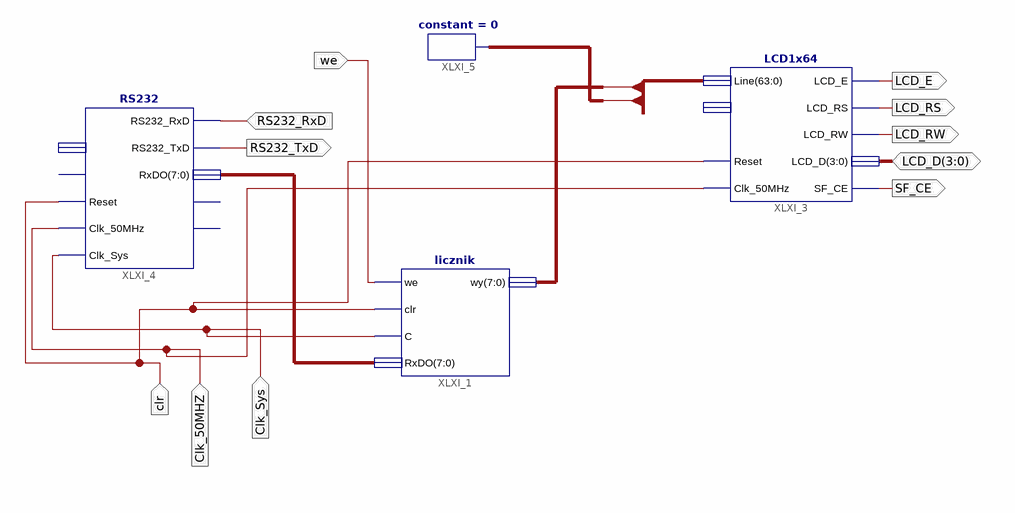
[diagram p0: schematic sheet 1]
// Xilinx ISE schematic CounterBit8ReverseSchema.sch (spartan3e) as structural Verilog: 4 symbols, 11 ports
module CounterBit8ReverseSchema (
  input  we,
  input  RS232_RxD,
  input  clr,
  input  Clk_50MHZ,
  input  Clk_Sys,
  inout  [3:0] LCD_D,
  output LCD_E,
  output LCD_RW,
  output LCD_RS,
  output SF_CE,
  output RS232_TxD
);

  wire [7:0] XLXN_35;
  wire [63:0] Line;

  licznik XLXI_1 (.we(we), .clr(clr), .C(Clk_Sys), .RxDO(XLXN_35), .wy(Line[63:56]));
  LCD1x64 XLXI_3 (
    .Clk_50MHz(Clk_50MHZ), .Reset(clr), .Line(Line), .LCD_D(LCD_D), .LCD_E(LCD_E), .LCD_RW(LCD_RW),
    .LCD_RS(LCD_RS), .SF_CE(SF_CE));  // open: Blank
  RS232 XLXI_4 (
    .Clk_50MHz(Clk_50MHZ), .Reset(clr), .RS232_RxD(RS232_RxD), .RS232_TxD(RS232_TxD), .RxDO(XLXN_35),
    .Clk_Sys(Clk_Sys));  // open: TxStart, TxDI, TxBusy, RxRdy
  constant #(.CValue("0")) XLXI_5 (.O(Line[55:0]));
endmodule
